# EAGLE design quadripod_v3Rb (EAGLE 9.3.0)
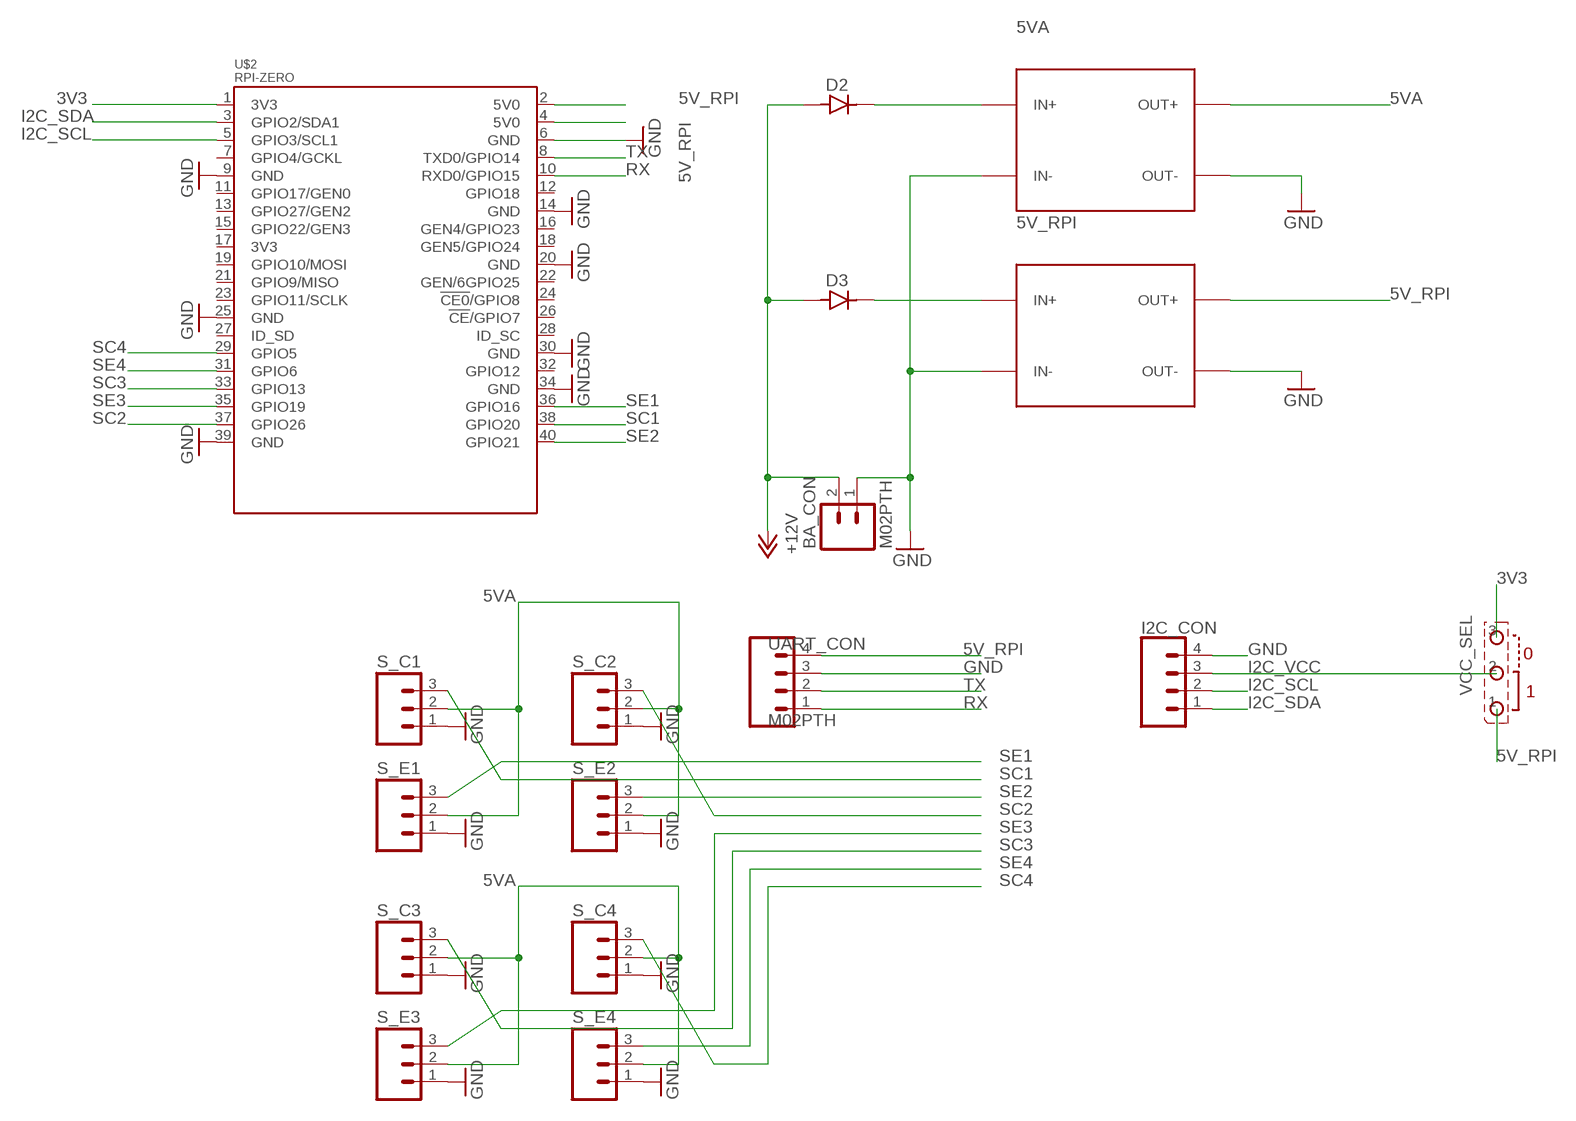
[diagram p0: schematic, sheet 1]

## Parts
5V_RPI  DC-DC-STEP-DOWN-LM2596  [DC-DC-STEP-DOWN-LM2596]
5VA  DC-DC-STEP-DOWN-LM2596  [DC-DC-STEP-DOWN-LM2596]
BA_CON  M02PTH  CONN_02PTH3  [1X02_LONGPADS]
D2  DIODES_DIODE/DO41  [DIODES_DO41]
D3  DIODES_DIODE/DO41  [DIODES_DO41]
I2C_CON  CONN_04LONGPADS  [1X04_LONGPADS]
S_C1  M03LONGPADS  [1X03_LONGPADS]
S_C2  M03LONGPADS  [1X03_LONGPADS]
S_C3  M03LONGPADS  [1X03_LONGPADS]
S_C4  M03LONGPADS  [1X03_LONGPADS]
S_E1  M03LONGPADS  [1X03_LONGPADS]
S_E2  M03LONGPADS  [1X03_LONGPADS]
S_E3  M03LONGPADS  [1X03_LONGPADS]
S_E4  M03LONGPADS  [1X03_LONGPADS]
U$2  RPI-ZERO  [RASPBERRYPI_BASTELSTUBE_V13_RASPI_BOARD_B+_FULL]
UART_CON  M02PTH  CONN_04LONGPADS  [1X04_LONGPADS]
VCC_SEL  STCMS_3/CMS  [STCMS_3]

## Nets
3V3 [5V_RPI]: U$2.1(3V3) VCC_SEL.3
5V_RPI [5V_RPI]: 5V_RPI.OUT+ U$2.2(5V0) U$2.4(5V0) UART_CON.4 VCC_SEL.1
5VA [power]: 5VA.OUT+ S_C1.2 S_C2.2 S_C3.2 S_C4.2 S_E1.2 S_E2.2 S_E3.2 S_E4.2
+12V [power]: BA_CON.2 D2.A D3.A
GND [power]: 5V_RPI.IN- 5V_RPI.OUT- 5VA.IN- 5VA.OUT- BA_CON.1 I2C_CON.4 S_C1.1 S_C2.1 S_C3.1 S_C4.1 S_E1.1 S_E2.1 S_E3.1 S_E4.1 U$2.6(GND) U$2.9(GND) U$2.14(GND) U$2.20(GND) U$2.25(GND) U$2.30(GND) U$2.34(GND) U$2.39(GND) UART_CON.3
I2C_SCL: I2C_CON.2 U$2.5(GPIO3/SCL1)
I2C_SDA: I2C_CON.1 U$2.3(GPIO2/SDA1)
I2C_VCC [5V_RPI]: I2C_CON.3 VCC_SEL.2
N$3: 5VA.IN+ D2.K
N$4: 5V_RPI.IN+ D3.K
RX: U$2.10(RXD0/GPIO15) UART_CON.1
SC1: S_C1.3 U$2.38(GPIO20)
SC2: S_C2.3 U$2.37(GPIO26)
SC3: S_C3.3 U$2.33(GPIO13)
SC4: S_C4.3 U$2.29(GPIO5)
SE1: S_E1.3 U$2.36(GPIO16)
SE2: S_E2.3 U$2.40(GPIO21)
SE3: S_E3.3 U$2.35(GPIO19)
SE4: S_E4.3 U$2.31(GPIO6)
TX: U$2.8(TXD0/GPIO14) UART_CON.2
Unconnected: U$2.7(GPIO4/GCKL) U$2.11(GPIO17/GEN0) U$2.12(GPIO18) U$2.13(GPIO27/GEN2) U$2.15(GPIO22/GEN3) U$2.16(GEN4/GPIO23) U$2.17(3V3) U$2.18(GEN5/GPIO24) U$2.19(GPIO10/MOSI) U$2.21(GPIO9/MISO) U$2.22(GEN/6GPIO25) U$2.23(GPIO11/SCLK) U$2.24(!CE0!/GPIO8) U$2.26(!CE!/GPIO7) U$2.27(ID_SD) U$2.28(ID_SC) U$2.32(GPIO12)

## Library data of the parts
5V_RPI 5VA = diy-modules:DC-DC-STEP-DOWN-LM2596: DC/DC Step-Down Regulator based on LM2596-ADJ chip LM2596 datasheet available here: http://www.ti.com/lit/ds/symlink/lm2596.pdf Click here to find device on ebay.com <http://www.ebay.com/sch/lm2596+power+regulator>
BA_CON = SparkFun-Connectors:CONN_02: Multi connection point. Often used as Generic Header-pin footprint for 0.1 inch spaced/style header connections On any of the 0.1 inch spaced packages, you can populate with these: Break Away Headers - Straight <https://www.sparkfun.com/products/116> (PRT-00116) Break Away Male Headers - Right Angle <https://www.sparkfun.com/products/553> (PRT-00553) Female Headers <https://www.sparkfun.com/products/115> (PRT-00115) Break Away Headers - Machine Pin <https://www.sparkfun.com/products/117> (PRT-00117) Break Away Female Headers - Swiss Machine Pin <https://www.sparkfun.com/products/743> (PRT-00743) For SCREWTERMINALS and SPRING TERMINALS visit here: Screw Terimnals on SparkFun.com <https://www.sparkfun.com/search/results?term=Screw+Terminals> (5mm/3.5mm/2.54mm spacing) This device is also useful as a general connection point to wire up your design to another part of your project. Our various solder wires solder well into these plated through hole pads. Hook-Up Wire - Assortment (Stranded, 22 AWG) <https://www.sparkfun.com/products/11375> (PRT-11375) Hook-Up Wire - Assortment (Solid Core, 22 AWG) <https://www.sparkfun.com/products/11367> (PRT-11367) View the entire wire category on our website here <https://www.sparkfun.com/categories/141> Special notes: Molex polarized connector foot print use with: PRT-08233 with associated crimp pins and housings. 2.54_SCREWTERM for use with PRT-10571. 3.5mm Screw Terminal footprints for PRT-08084 5mm Screw Terminal footprints for use with PRT-08432
D2 D3 = 7robot:DIODES_DIODE: BAS32L => SOD80
I2C_CON UART_CON = SparkFun-Connectors:CONN_04: Multi connection point. Often used as Generic Header-pin footprint for 0.1 inch spaced/style header connections On any of the 0.1 inch spaced packages, you can populate with these: Break Away Headers - Straight <https://www.sparkfun.com/products/116> (PRT-00116) Break Away Male Headers - Right Angle <https://www.sparkfun.com/products/553> (PRT-00553) Female Headers <https://www.sparkfun.com/products/115> (PRT-00115) Break Away Headers - Machine Pin <https://www.sparkfun.com/products/117> (PRT-00117) Break Away Female Headers - Swiss Machine Pin <https://www.sparkfun.com/products/743> (PRT-00743) For SCREWTERMINALS and SPRING TERMINALS visit here: Screw Terimnals on SparkFun.com <https://www.sparkfun.com/search/results?term=Screw+Terminals> (5mm/3.5mm/2.54mm spacing) This device is also useful as a general connection point to wire up your design to another part of your project. Our various solder wires solder well into these plated through hole pads. Hook-Up Wire - Assortment (Stranded, 22 AWG) <https://www.sparkfun.com/products/11375> (PRT-11375) Hook-Up Wire - Assortment (Solid Core, 22 AWG) <https://www.sparkfun.com/products/11367> (PRT-11367) View the entire wire category on our website here <https://www.sparkfun.com/categories/141> Special notes: Molex polarized connector foot print use with SKU : PRT-08231 with associated crimp pins and housings. 1MM SMD Version SKU: PRT-10208; PROD_ID: CONN-09696
S_C1-S_C4 S_E1-S_E4 = 7robot:M03: Header 3 Standard 3-pin 0.1" header. Use with straight break away headers (SKU : PRT-00116), right angle break away headers (PRT-00553), swiss pins (PRT-00743), machine pins (PRT-00117), and female headers (PRT-00115). Molex polarized connector foot print use with SKU : PRT-08232 with associated crimp pins and housings.
U$2 = RPI-Zero:RPI-ZERO
VCC_SEL = 7robot:STCMS_3

## Net classes
0 default: width 0.5 mm, drill 0.2 mm, clearance 0.25 mm
1 power: width 1 mm, drill 0.5 mm, clearance 0.5 mm
2 5V_RPI: width 1 mm, drill 0.5 mm, clearance 0.35 mm
3 signal: width 0.15 mm, drill 0.3 mm, clearance 0.006 mm

## Board
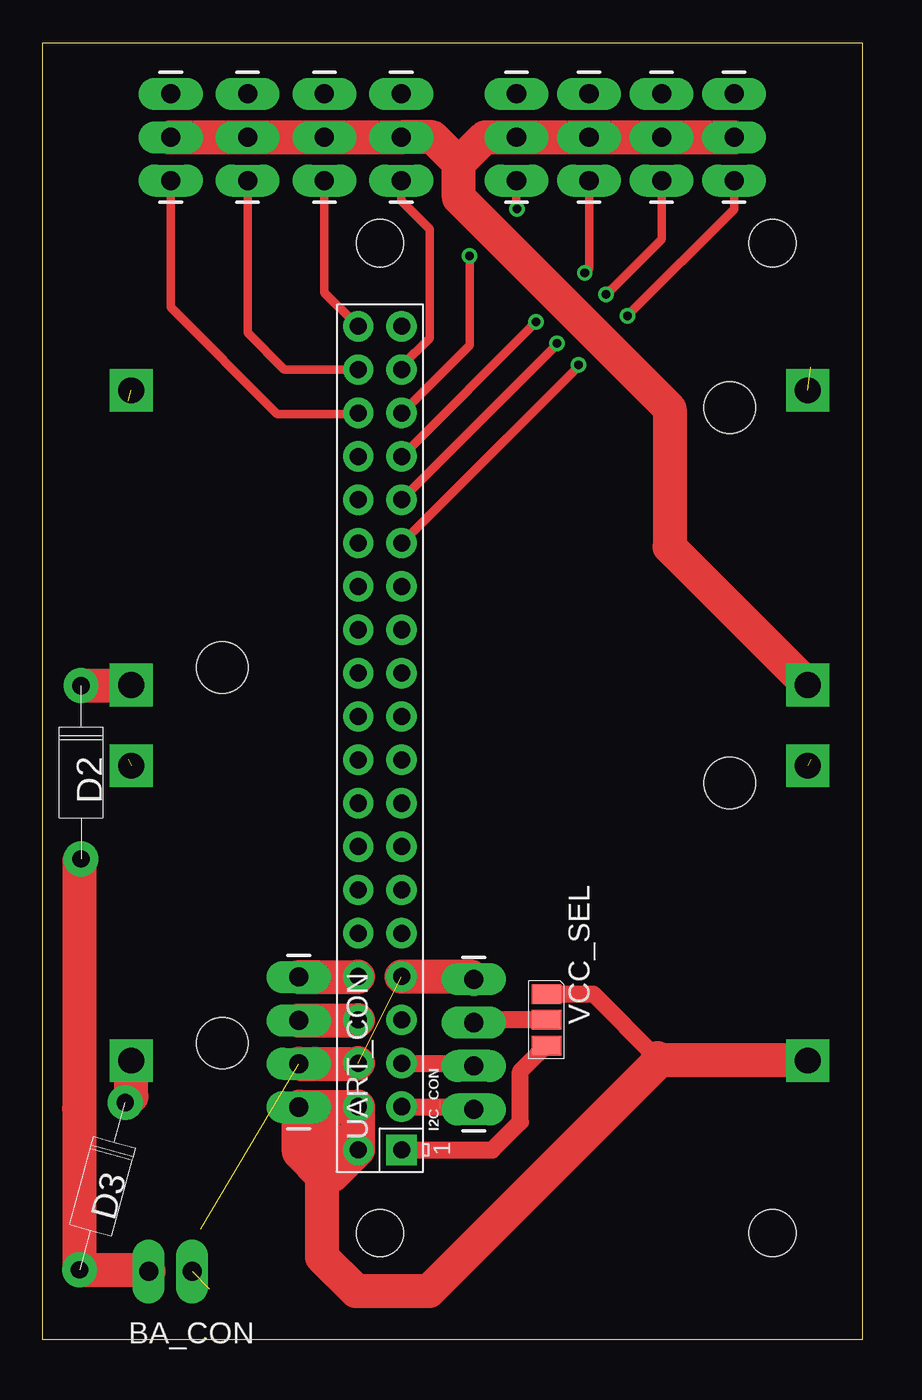
[diagram p1: board, top side]
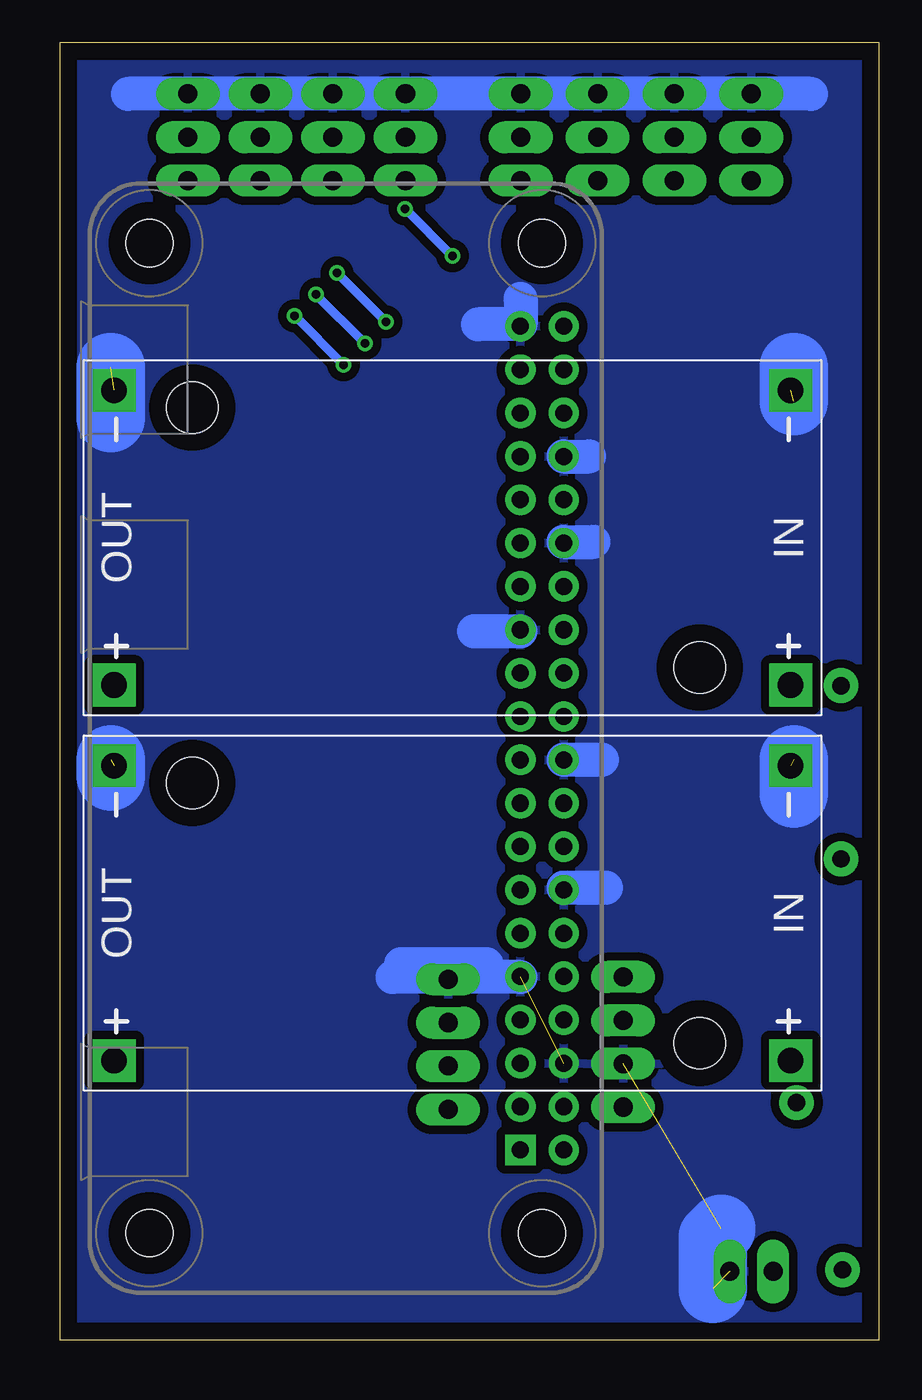
[diagram p2: board, bottom side, seen from below]

Size 48 x 76 mm. Coordinates in mm from the lower left corner, seen from the top.
Outline: 0,0 0,76 48,76 48,0 0,0
Copper layers (1*16): Top 0.035mm / dielectric 1.5mm / Bottom 0.035mm
Design rules "default": minimum track width 6mil, minimum drill 0.35mm, track to track 6mil, track to pad 6mil, pad to pad 6mil, via to via 6mil, smd to smd 6mil, copper to edge 40mil, drill to drill 6mil, minimum pad ring 10mil, minimum via ring 8mil, stop-mask expansion 4mil, vias tented up to drill 0mil, thermal gap 10mil

### Footprints (pad centres in the part's own frame; a part is rotated, then mirrored left to right if it is on the bottom)
DC-DC-STEP-DOWN-LM2596 = drill 1.5 pad 2.5 square: IN+ -19.812,8.636; IN- -19.812,-8.636; OUT+ 19.812,8.636; OUT- 19.812,-8.636 | hole 3: -14.478,7.62; 15.24,-7.62
1X02_LONGPADS = drill 1.118 pad 1.88 long: 1 0,0; 2 2.54,0
DIODES_DO41 = drill 1.016 pad 2.032: A 5.08,0; K -5.08,0
1X04_LONGPADS = drill 1.118 pad 1.88 long: 1 0,0; 2 2.54,0; 3 5.08,0; 4 7.62,0
1X03_LONGPADS = drill 1.118 pad 1.88 long: 1 0,0; 2 2.54,0; 3 5.08,0
RASPBERRYPI_BASTELSTUBE_V13_RASPI_BOARD_B+_FULL = drill 1 pad 1.778 square: 1 8.37,25.23 | drill 1 pad 1.778: 2 8.37,27.77; 3 10.91,25.23; 4 10.91,27.77; 5 13.45,25.23; 6 13.45,27.77; 7 15.99,25.23; 8 15.99,27.77; 9 18.53,25.23; 10 18.53,27.77; 11 21.07,25.23; 12 21.07,27.77; 13 23.61,25.23; 14 23.61,27.77; 15 26.15,25.23; 16 26.15,27.77; 17 28.69,25.23; 18 28.69,27.77; 19 31.23,25.23; 20 31.23,27.77; 21 33.77,25.23; 22 33.77,27.77; 23 36.31,25.23; 24 36.31,27.77; 25 38.85,25.23; 26 38.85,27.77; 27 41.39,25.23; 28 41.39,27.77; 29 43.93,25.23; 30 43.93,27.77; 31 46.47,25.23; 32 46.47,27.77; 33 49.01,25.23; 34 49.01,27.77; 35 51.55,25.23; 36 51.55,27.77; 37 54.09,25.23; 38 54.09,27.77; 39 56.63,25.23; 40 56.63,27.77 | hole 2.75: 3.5,3.5; 3.5,26.5; 61.5,3.5; 61.5,26.5
STCMS_3 = smd 1.727 x 1.143: 1 0,-1.508; 2 0,0; 3 0,1.508

### Placement (x,y rotation side)
5V_RPI  25,25 180 bottom
5VA  25,47 180 bottom
BA_CON  8.75,4 0 bottom
D2  2.25,33.25 270 top
D3  3.5,9 254.7 top
I2C_CON  25.25,13.5 90 top
S_C1  12,73 270 top
S_C2  21,73 270 top
S_C3  32,73 270 top
S_C4  40.5,73 270 top
S_E1  7.5,73 270 top
S_E2  16.5,73 270 top
S_E3  27.75,73 270 top
S_E4  36.25,73 270 top
U$2  46.25,2.75 90 top
UART_CON  15,21.25 270 top
VCC_SEL  29.5,18.75 180 top

### Tracks (layer width: path | path; a pad name or v marks a point on that pad's centre or on a via)
3V3
  Top 1: VCC_SEL.3 27.98,15.72 27.98,12.76 26.34,11.12 U$2.1
5V_RPI
  Top 1: VCC_SEL.1 32.24,20.26 36,16.5
  Top 2: 5V_RPI.OUT+ 36.14,16.36 | 36.14,16.36 36,16.5 | 15,11 UART_CON.4 | UART_CON.4 15.03,13.66 U$2.4 U$2.2 | 15,11 15.12,11.12 U$2.2 | U$2.2 17.51,11.12 UART_CON.4 | 15,11 16.36,9.64 | 16.36,9.64 16.36,4.84 18.34,2.86 22.63,2.86 36.14,16.36 | U$2.2 17,9.64 16.36,9.64
5VA
  Top 2: S_E1.2 S_C1.2 S_E2.2 S_C2.2 22.84,70.46 24.37,68.93 | 5VA.OUT+ 36.72,46.45 36.72,54.56 24.37,66.91 24.37,68.93 | S_C4.2 S_E4.2 S_C3.2 S_E3.2 25.9,70.46 24.37,68.93
+12V
  Top 2: BA_CON.2 6.11,4.1 D3.A 2.16,13.52 2.14,13.56 2.16,13.63 2.16,28.08 D2.A
GND  (7 unrouted)
  Top 2: UART_CON.3 18.45,16.17 U$2.6 | U$2.9 25.09,21.28 I2C_CON.4
  Bottom 2: 18.5,46.75 16.75,46.75 | 18.5,51.75 17,51.75 | 21,41.5 23.75,41.5 | 21,21.25 28.5,21.25 | 23,22 28,22 | 18.5,26.5 16,26.5 | 18.5,34 16.25,34 | 21,61 21,59.5 23.5,59.5 | 4,73 44,73
  Bottom 4: 5,57 5,55 | 5,34 5,32 | 45,34 45,33 | 45,57 45,54 | 9.25,6.5 9.75,6 9.75,3
  pour Bottom: -2,-2 -2,98 50,98 50,-2
I2C_SCL
  Top 1: U$2.5 25.09,16.2 I2C_CON.2
I2C_SDA
  Top 1: U$2.3 25.09,13.66 I2C_CON.1
I2C_VCC
  Top 1: VCC_SEL.2 25.42,18.75 I2C_CON.3
N$3
  Top 2: D2.K 5.15,38.33 5VA.IN+
N$4
  Top 2: D3.K 5.19,14.25 5V_RPI.IN+
RX
  Top 2: UART_CON.1 18.45,21.25 U$2.10
SC1
  Top 0.5: S_C1.3 12,59 14.16,56.84 U$2.38
SC2
  Top 0.5: U$2.37 21,56.86 21,57.04 22.66,58.7 22.66,65.08 21,66.73 S_C2.3
SC3  (via drill 0.5)
  Top 0.5: U$2.33 v28.88,59.62 v28.88,59.63 | v31.75,62.5 32,62.75 S_C3.3
  Bottom 0.5: v28.88,59.63 v31.75,62.5
SC4  (via drill 0.5)
  Top 0.5: U$2.29 31.38,57.04 v31.38,57.13 | v34.25,60 40.5,66.25 S_C4.3
  Bottom 0.5: v31.38,57.13 v34.25,60
SE1
  Top 0.5: S_E1.3 7.5,60.5 13.75,54.25 18.43,54.25 U$2.36
SE2
  Top 0.5: S_E2.3 16.5,61.36 U$2.40
SE3  (via drill 0.5)
  Top 0.5: S_E3.3 27.75,66.29 v27.77,66.27 | v25,63.5 25,58.28 U$2.35
  Bottom 0.5: v27.77,66.27 v25,63.5
SE4  (via drill 0.5)
  Top 0.5: U$2.31 30.13,58.33 v30.13,58.38 | v33,61.25 36.25,64.5 S_E4.3
  Bottom 0.5: v30.13,58.38 v33,61.25
TX
  Top 2: UART_CON.2 18.45,18.71 U$2.8

### Text on the board
tDocu: Thib-s / v3.0 Rev B